# EAGLE design hv4layerSWV2 (EAGLE 6.6.0)
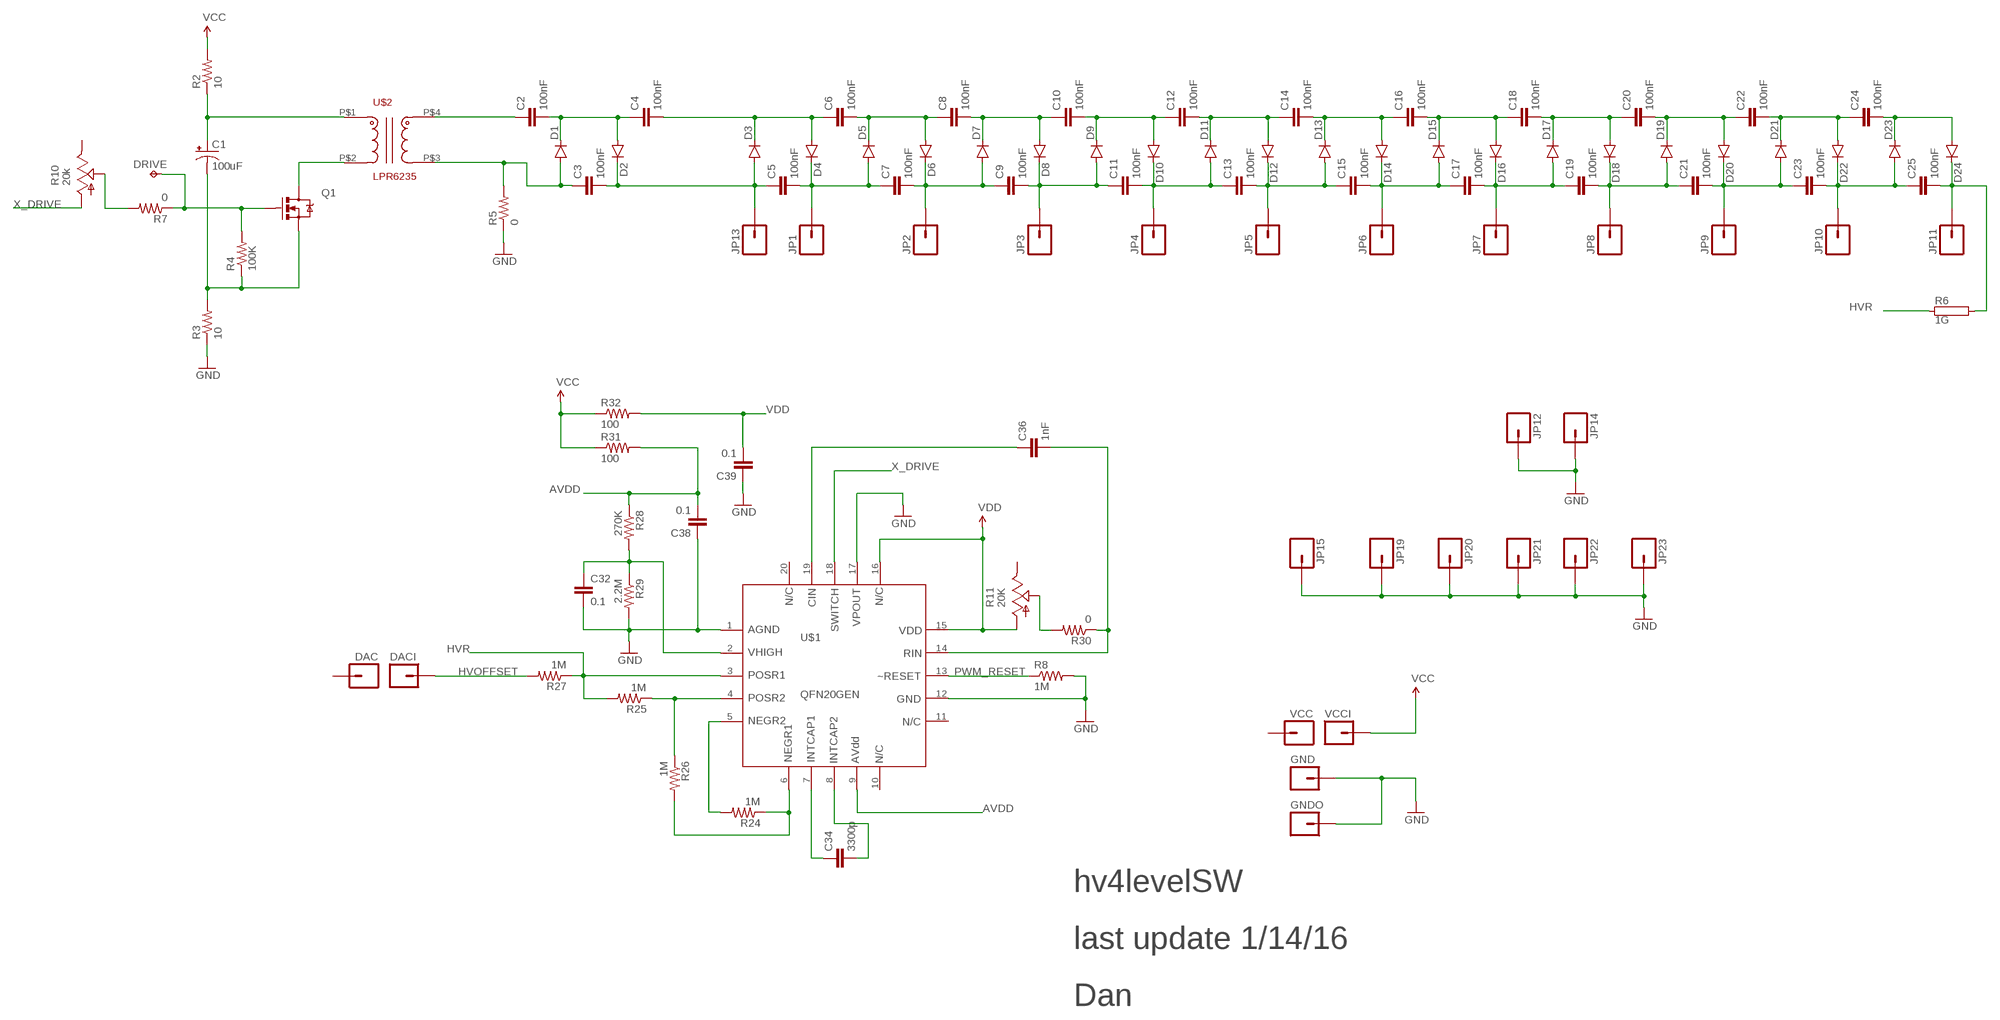
[diagram p0: schematic, sheet 1]

## Parts
C1  100uF  CAP_POL6032  [EIA6032]
C2  100nF  CAP1210  [1210]
C3  100nF  CAP1210  [1210]
C4  100nF  CAP1210  [1210]
C5  100nF  CAP1210  [1210]
C6  100nF  CAP1210  [1210]
C7  100nF  CAP1210  [1210]
C8  100nF  CAP1210  [1210]
C9  100nF  CAP1210  [1210]
C10  100nF  CAP1210  [1210]
C11  100nF  CAP1210  [1210]
C12  100nF  CAP1210  [1210]
C13  100nF  CAP1210  [1210]
C14  100nF  CAP1210  [1210]
C15  100nF  CAP1210  [1210]
C16  100nF  CAP1210  [1210]
C17  100nF  CAP1210  [1210]
C18  100nF  CAP1210  [1210]
C19  100nF  CAP1210  [1210]
C20  100nF  CAP1210  [1210]
C21  100nF  CAP1210  [1210]
C22  100nF  CAP1210  [1210]
C23  100nF  CAP1210  [1210]
C24  100nF  CAP1210  [1210]
C25  100nF  CAP1210  [1210]
C32  0.1  22UF-6.3V-20%(0805)  [0805]
C34  3300p  22UF-6.3V-20%(0805)  [0805]
C36  1nF  22UF-6.3V-20%(0805)  [0805]
C38  0.1  22UF-6.3V-20%(0805)  [0805]
C39  0.1  22UF-6.3V-20%(0805)  [0805]
D1  DIODESOT23  [SOT23-3]
D2  DIODESOT23  [SOT23-3]
D3  DIODESOT23  [SOT23-3]
D4  DIODESOT23  [SOT23-3]
D5  DIODESOT23  [SOT23-3]
D6  DIODESOT23  [SOT23-3]
D7  DIODESOT23  [SOT23-3]
D8  DIODESOT23  [SOT23-3]
D9  DIODESOT23  [SOT23-3]
D10  DIODESOT23  [SOT23-3]
D11  DIODESOT23  [SOT23-3]
D12  DIODESOT23  [SOT23-3]
D13  DIODESOT23  [SOT23-3]
D14  DIODESOT23  [SOT23-3]
D15  DIODESOT23  [SOT23-3]
D16  DIODESOT23  [SOT23-3]
D17  DIODESOT23  [SOT23-3]
D18  DIODESOT23  [SOT23-3]
D19  DIODESOT23  [SOT23-3]
D20  DIODESOT23  [SOT23-3]
D21  DIODESOT23  [SOT23-3]
D22  DIODESOT23  [SOT23-3]
D23  DIODESOT23  [SOT23-3]
D24  DIODESOT23  [SOT23-3]
DAC  M01PTH  [1X01]
DACI  M01PTH  [1X01]
DRIVE  TPTP20R  [TP20R]
GND  M01PTH  [1X01]
GNDO  M01PTH  [1X01]
JP1  M01PTH  [1X01]
JP2  M01PTH  [1X01]
JP3  M01PTH  [1X01]
JP4  M01PTH  [1X01]
JP5  M01PTH  [1X01]
JP6  M01PTH  [1X01]
JP7  M01PTH  [1X01]
JP8  M01PTH  [1X01]
JP9  M01PTH  [1X01]
JP10  M01PTH  [1X01]
JP11  M01PTH  [1X01]
JP12  M01PTH  [1X01]
JP13  M01PTH  [1X01]
JP14  M01PTH  [1X01]
JP15  M01PTH  [1X01]
JP19  M01PTH  [1X01]
JP20  M01PTH  [1X01]
JP21  M01PTH  [1X01]
JP22  M01PTH  [1X01]
JP23  M01PTH  [1X01]
Q1  MOSFET-NCHANNELAO3404A  [SOT23-3]
R2  10  RESISTOR2512  [R2512]
R3  10  RESISTOR2512  [R2512]
R4  100K  RESISTOR0805-RES  [0805]
R5  0  RESISTOR0805-RES  [0805]
R6  1G  RCA4090  [CA4090]
R7  0  RESISTOR0805-RES  [0805]
R8  1M  RESISTOR0805-RES  [0805]
R10  20k  TRIM_US-3223W  [3223W]
R11  20K  TRIM_US-3223W  [3223W]
R24  1M  RESISTOR0805-RES  [0805]
R25  1M  RESISTOR0805-RES  [0805]
R26  1M  RESISTOR0805-RES  [0805]
R27  1M  RESISTOR0805-RES  [0805]
R28  270K  RESISTOR0805-RES  [0805]
R29  2.2M  RESISTOR0805-RES  [0805]
R30  0  RESISTOR0805-RES  [0805]
R31  100  RESISTOR0805-RES  [0805]
R32  100  RESISTOR0805-RES  [0805]
U$1  QFN20GEN  [QFN20]
U$2  LPR6235  [LPR6235]
VCC  M01PTH  [1X01]
VCCI  M01PTH  [1X01]

## Nets
AVDD: C38.2 R28.1 R31.2 U$1.9
GND: C32.2 C38.1 C39.1 GND.1 GNDO.1 JP12.1 JP14.1 JP15.1 JP19.1 JP20.1 JP21.1 JP22.1 JP23.1 R3.1 R5.1 R8.2 R29.2 U$1.1 U$1.12 U$1.17
HVOFFSET: DACI.1 R27.2
HVR: R6.1 R25.2 R27.1 U$1.3
N$1: C2.1 U$2.P$4
N$2: C1.P$2(-) Q1.2(S) R3.2 R4.1
N$3: C3.1 D1.1(A) R5.2 U$2.P$3
N$4: DRIVE.TP Q1.1(G) R4.2 R7.1
N$5: C2.2 C4.1 D1.3(C) D2.1(A)
N$6: R24.1 R26.2 U$1.6
N$7: Q1.3(D) U$2.P$2
N$8: R11.2(S) R30.2
N$9: C3.2 C5.1 D2.3(C) D3.1(A) JP13.1
N$10: C4.2 C6.1 D3.3(C) D4.1(A)
N$11: C5.2 C7.1 D4.3(C) D5.1(A) JP1.1
N$12: C6.2 C8.1 D5.3(C) D6.1(A)
N$13: C7.2 C9.1 D6.3(C) D7.1(A) JP2.1
N$14: C23.2 C25.1 D22.3(C) D23.1(A) JP10.1
N$15: R24.2 U$1.5
N$18: C8.2 C10.1 D7.3(C) D8.1(A)
N$20: C9.2 C11.1 D8.3(C) D9.1(A) JP3.1
N$21: C1.P$1(+) R2.1 U$2.P$1
N$22: C10.2 C12.1 D9.3(C) D10.1(A)
N$23: C11.2 C13.1 D10.3(C) D11.1(A) JP4.1
N$24: C12.2 C14.1 D11.3(C) D12.1(A)
N$25: C14.2 C16.1 D13.3(C) D14.1(A)
N$26: C13.2 C15.1 D12.3(C) D13.1(A) JP5.1
N$27: C15.2 C17.1 D14.3(C) D15.1(A) JP6.1
N$28: C17.2 C19.1 D16.3(C) D17.1(A) JP7.1
N$29: C19.2 C21.1 D18.3(C) D19.1(A) JP8.1
N$30: C16.2 C18.1 D15.3(C) D16.1(A)
N$31: C18.2 C20.1 D17.3(C) D18.1(A)
N$32: C20.2 C22.1 D19.3(C) D20.1(A)
N$33: C21.2 C23.1 D20.3(C) D21.1(A) JP9.1
N$34: C22.2 C24.1 D21.3(C) D22.1(A)
N$35: C24.2 D23.3(C) D24.1(A)
N$36: C25.2 D24.3(C) JP11.1 R6.2
N$37: R7.2 R10.2(S)
N$43: C34.1 U$1.7
N$49: R25.1 R26.1 U$1.4
N$61: C34.2 U$1.8
N$63: C32.1 R28.2 R29.1 U$1.2
N$64: C36.2 R30.1 U$1.14
N$65: C36.1 U$1.19
PWM_RESET: R8.1 U$1.13
VCC: R2.2 R31.1 R32.1 VCCI.1
VDD: C39.2 R11.1(A) R32.2 U$1.15 U$1.16
X_DRIVE: R10.1(A) U$1.18
Unconnected: DAC.1 R10.3(E) R11.3(E) U$1.10 U$1.11 U$1.20 VCC.1

## Notes on the sheet
- hv4levelSW
- last update 1/14/16
- Dan

## Library data of the parts
C1 = SparkFun-Capacitors:CAP_POL: Capacitor Polarized These are standard SMD and PTH capacitors. Normally 10uF, 47uF, and 100uF in electrolytic and tantalum varieties. Always verify the external diameter of the through hole cap, it varies with capacity, voltage, and manufacturer. The EIA devices should be standard.
C2-C25 = SparkFun-Capacitors:CAP: Capacitor Standard 0603 ceramic capacitor, and 0.1" leaded capacitor.
C32 C34 C36 C38 C39 = SparkFun-Capacitors:22UF-6.3V-20%(0805): CAP-08402 Ceramic; PROD_ID: CAP-08402; VALUE: 22uF
D1-D24 = SparkFun-DiscreteSemi:DIODE: Diode These are standard reverse protection diodes and small signal diodes. SMA package can handle up to about 1A. SOD-323 can handle about 200mA. What the SOD-323 package when ordering, there are some mfgs out there that are 5-pin packages.
DAC DACI GND GNDO JP1-JP15 JP19-JP23 VCC VCCI = SparkFun-Connectors:M01: Header 1 Standard 1-pin 0.1" header. Use with straight break away headers (SKU : PRT-00116), right angle break away headers (PRT-00553), swiss pins (PRT-00743), machine pins (PRT-00117), and female headers (PRT-00115).
DRIVE = testpad:TP: Test pad
Q1 = SparkFun-DiscreteSemi:MOSFET-NCHANNEL: Common NMOSFET Parts MFG P/N Store ID Prod ID FDD8780 TRANS-09984 SI7820DN TRANS-11055 FDS6630A IC-08089 2N7002PW TRANS-11151 FQP30N06L COM-10213 TRANS-10060 BSS123LT1G TRANS-08345 BSS138 TRANS-00830 BS170 2N7000; PROD_ID: TRAN-12988
R2 R3 = SparkFun-Resistors:RESISTOR: Resistor Basic schematic elements and footprints for 0603, 1206, and PTH resistors.
R4 R5 R7 R8 R24-R32 = SparkFun-Passives:RESISTOR: Resistor Basic schematic elements and footprints for 0603, 1206, and PTH resistors.
R6 = resistor-power:R: Power Resitor; OC_FARNELL: unknown; OC_NEWARK: unknown
R10 R11 = pot:TRIM_US-: POTENTIOMETER
U$1 = specials:QFN20GEN
U$2 = inductor-coilcraft-2:LPR6235

## Board
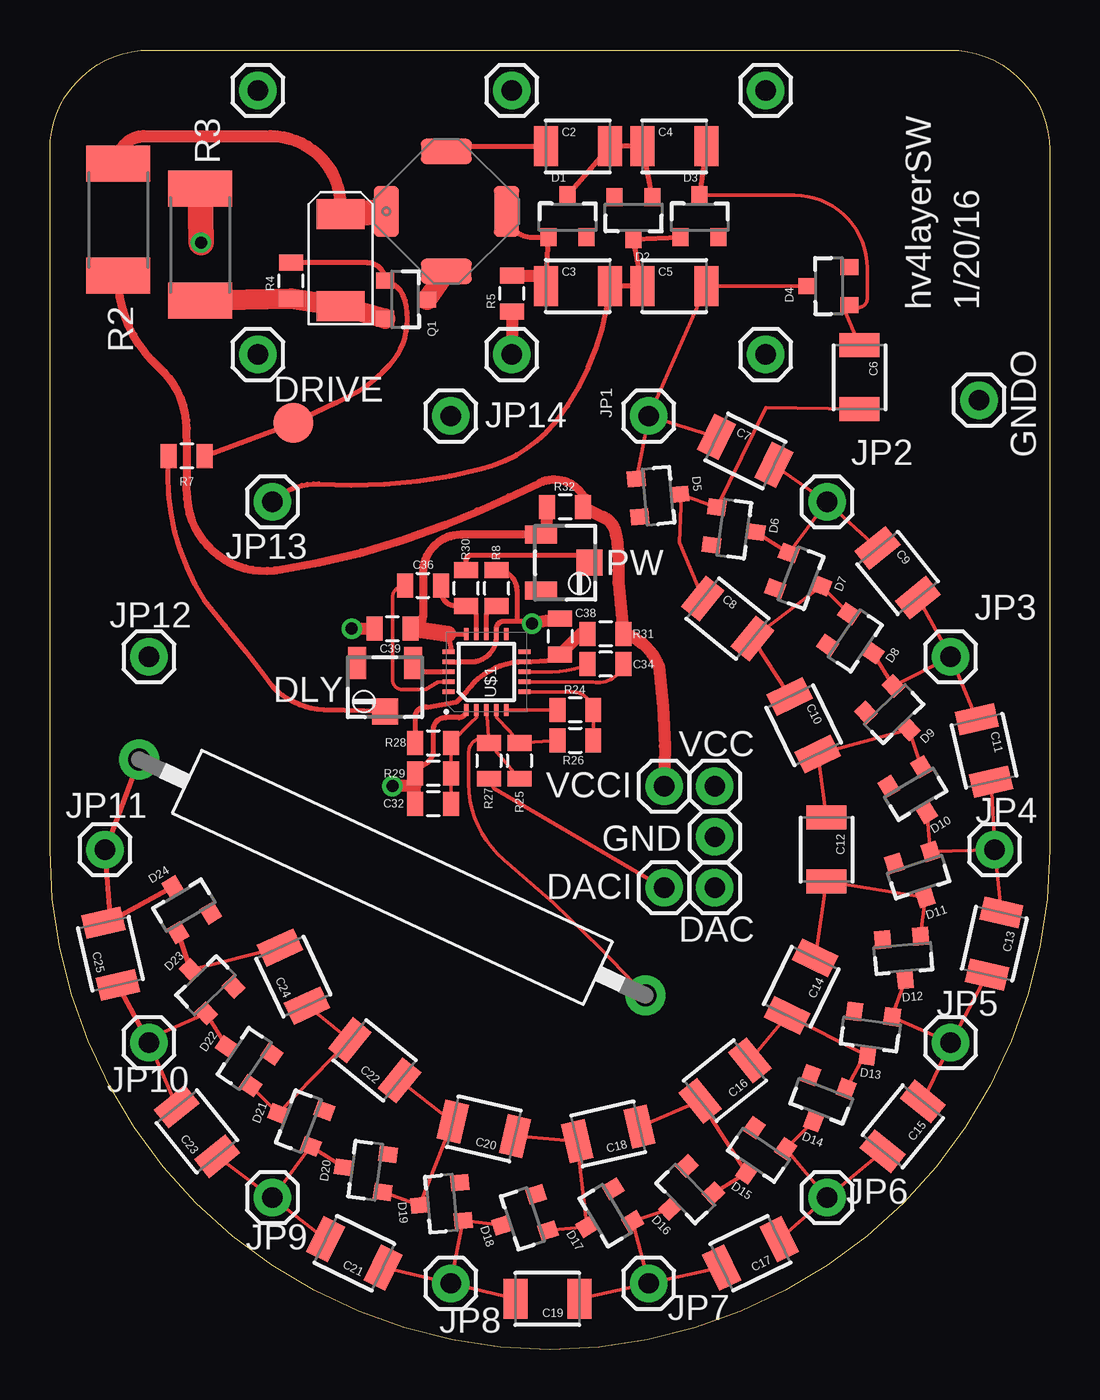
[diagram p1: board, top side]
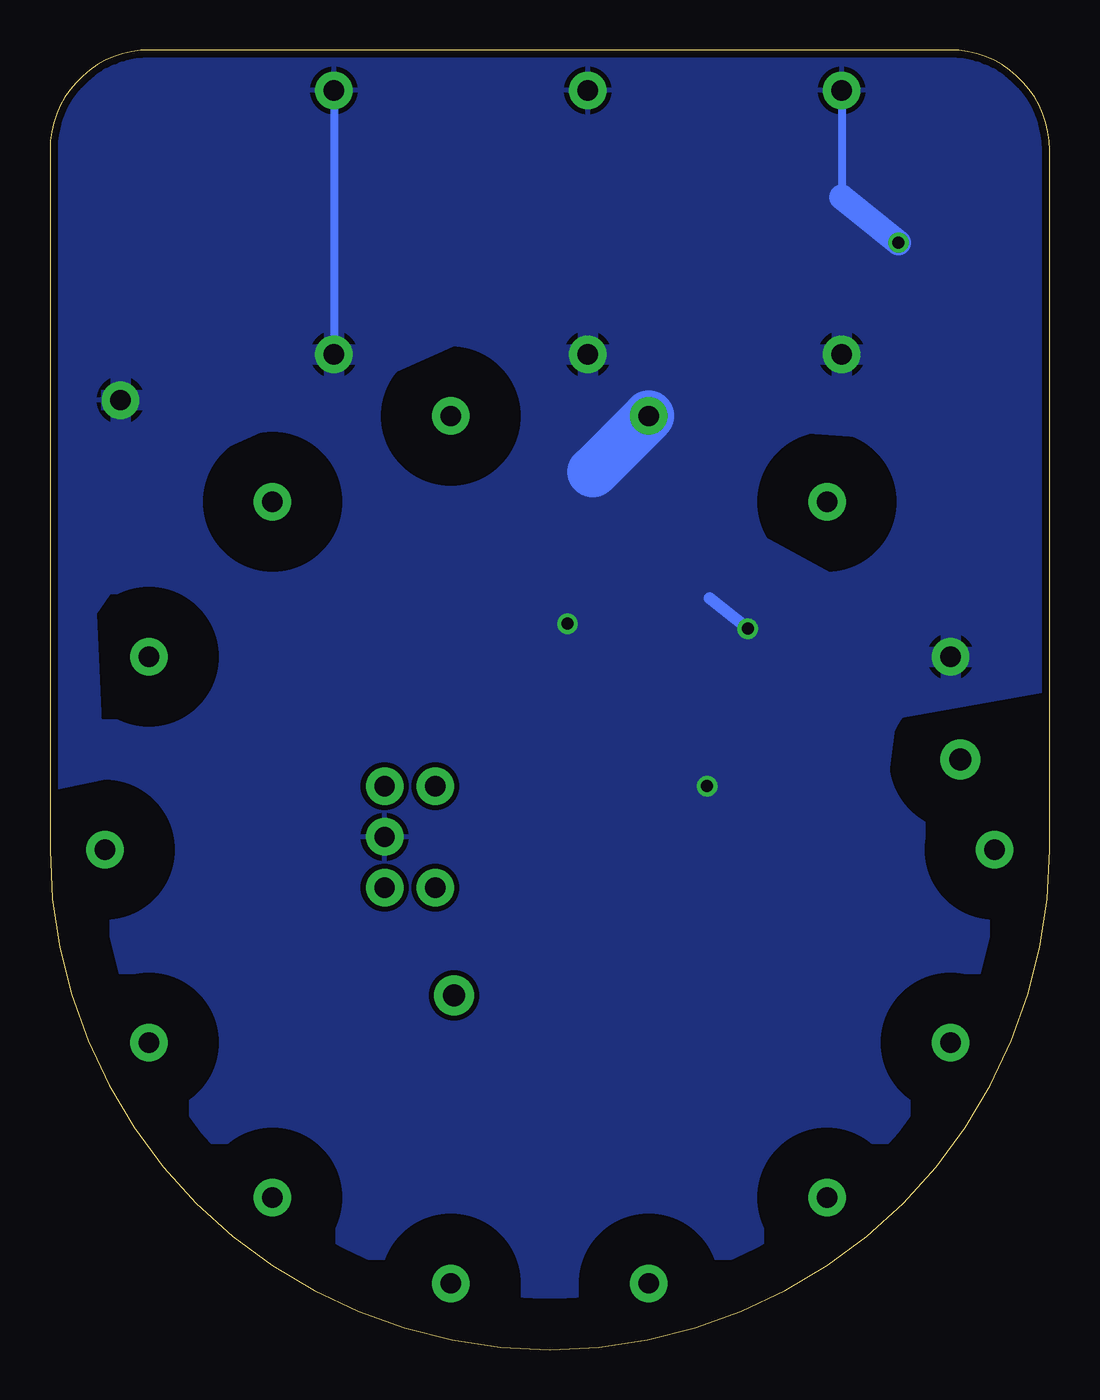
[diagram p2: board, bottom side, seen from below]

Size 50 x 65 mm. Coordinates in mm from the lower left corner, seen from the top.
Outline: 0,25 0,60 arc-90 5,65 45,65 arc-90 50,60 50,25 arc-180 0,25
Copper layers (1*16): Top 0.0356mm / dielectric 1.5011mm / Bottom 0.0356mm
Design rules "oshpark": minimum track width 6mil, minimum drill 13mil, track to track 6mil, track to pad 6mil, pad to pad 6mil, via to via 6mil, smd to smd 6mil, copper to edge 15mil, drill to drill 6mil, minimum pad ring 7mil, minimum via ring 7mil, stop-mask expansion 3mil, vias tented up to drill 0mil, thermal gap 10mil

### Footprints (pad centres in the part's own frame; a part is rotated, then mirrored left to right if it is on the bottom)
EIA6032 = smd 1.5 x 2.4: P$1 -2.3,0; P$2 2.3,0
1210 = smd 1.2 x 2: 1 -1.6,0; 2 1.6,0
0805 = smd 0.8 x 1.2: 1 -0.9,0; 2 0.9,0
SOT23-3 = smd 0.8 x 0.9: 1 -0.95,-1; 2 0.95,-1; 3 0,1.1
1X01 = drill 1.016 pad 1.88: 1 0,0
TP20R = smd 2 x 2: TP 0,0
R2512 = smd 1.8 x 3.2: 1 -2.8,0; 2 2.8,0
CA4090 = drill 1.1 pad 2: 1 -13.97,0; 2 13.97,0
3223W = smd 0.9 x 1.6: 1 -1.4,-1.215; 3 1.4,-1.215 | smd 1.3 x 1.3: 2 0,1.215
QFN20 = smd 0.6 x 0.23: 1 -1.9,1; 2 -1.9,0.5; 3 -1.9,0; 4 -1.9,-0.5; 5 -1.9,-1; 11 1.9,-1; 12 1.9,-0.5; 13 1.9,0; 14 1.9,0.5; 15 1.9,1 | smd 0.23 x 0.6: 6 -1,-1.9; 7 -0.5,-1.9; 8 0,-1.9; 9 0.5,-1.9; 10 1,-1.9; 16 1,1.9; 17 0.5,1.9; 18 0,1.9; 19 -0.5,1.9; 20 -1,1.9
LPR6235 = smd 2.54 x 1.27 rotated 45: P$1 -2.125,2.125; P$3 2.125,-2.125 | smd 2.54 x 1.27 rotated 135: P$2 -2.125,-2.125; P$4 2.125,2.125

### Placement (x,y rotation side)
C1  14.53,54.5 270 top
C2  26.4,60.18 0 top
C3  26.4,53.2 0 top
C4  31.23,60.18 0 top
C5  31.23,53.2 0 top
C6  40.5,48.63 270 top
C7  34.78,44.94 334 top
C8  33.9,36.56 321 top
C9  42.4,38.85 309 top
C10  37.7,31.23 296 top
C11  46.72,29.96 283 top
C12  38.85,25.01 270 top
C13  47.23,20.31 257 top
C14  37.58,18.15 244 top
C15  42.66,11.16 231 top
C16  33.77,13.45 219 top
C17  35.04,4.81 206 top
C18  27.93,10.78 193 top
C19  24.88,2.53 180 top
C20  21.7,11.04 167 top
C21  15.23,4.81 154 top
C22  16.24,14.46 141 top
C23  7.35,10.91 129 top
C24  12.18,18.66 115 top
C25  3.03,19.8 103 top
C32  19.16,27.29 180 top
C34  27.8,34.28 180 top
C36  18.66,38.21 0 top
C38  25.51,35.67 270 top
C39  17.13,36.05 0 top
D1  25.89,56.63 0 top
D2  29.2,56.63 180 top
D3  32.5,56.63 0 top
D4  38.98,53.2 90 top
D5  30.41,42.69 275 top
D6  34.21,41.04 262 top
D7  37.55,38.59 249 top
D8  40.26,35.46 236 top
D9  42.2,31.8 224 top
D10  43.29,27.8 211 top
D11  43.45,23.66 198 top
D12  42.69,19.59 185 top
D13  41.04,15.79 172 top
D14  38.59,12.45 159 top
D15  35.46,9.74 146 top
D16  31.8,7.8 134 top
D17  27.8,6.71 121 top
D18  23.66,6.55 108 top
D19  19.59,7.31 95 top
D20  15.79,8.96 82 top
D21  12.45,11.41 69 top
D22  9.74,14.54 56 top
D23  7.8,18.2 44 top
D24  6.71,22.2 31 top
DAC  33.26,23.1 0 top
DACI  30.72,23.1 0 top
DRIVE  12.18,46.34 0 top
GND  33.26,25.64 0 top
GNDO  46.47,47.48 0 top
JP1  29.95,46.69 0 top
JP2  38.87,42.4 0 top
JP3  45.05,34.65 0 top
JP4  47.25,25 0 top
JP5  45.05,15.35 0 top
JP6  38.87,7.6 0 top
JP7  29.95,3.31 0 top
JP8  20.05,3.31 0 top
JP9  11.13,7.6 0 top
JP10  4.95,15.35 0 top
JP11  2.75,25 0 top
JP12  4.95,34.65 0 top
JP13  11.13,42.4 0 top
JP14  20.05,46.69 0 top
JP15  10.4,62.98 0 top
JP19  23.1,62.98 0 top
JP20  35.8,49.77 0 top
JP21  23.1,49.77 0 top
JP22  10.4,49.77 0 top
JP23  35.8,62.98 0 top
Q1  17.76,52.52 270 top
R2  3.41,56.5 270 top
R3  7.5,55.26 270 top
R4  12.05,53.45 90 top
R5  23.1,52.82 90 top
R6  17.13,23.61 155 top
R7  6.84,44.69 180 top
R8  22.34,38.09 90 top
R10  16.75,33.13 180 top
R11  25.77,39.36 270 top
R24  26.27,31.99 180 top
R25  23.48,29.45 270 top
R26  26.27,30.47 0 top
R27  21.96,29.45 270 top
R28  19.16,30.34 0 top
R29  19.16,28.81 180 top
R30  20.81,38.09 90 top
R31  27.8,35.8 180 top
R32  25.77,42.15 180 top
U$1  21.83,33.9 90 top
U$2  19.83,56.92 45 top
VCC  33.26,28.18 0 top
VCCI  30.72,28.18 0 top

### Tracks (layer width: path | path; a pad name or v marks a point on that pad's centre or on a via)
AVDD
  Top 0.254: C38.2 arc-90 25.24,34.5 U$1.9 arc55 20.81,32.88 20.31,32.37 18.91,32.12 arc90 18.26,31.73 R28.1
  Top 0.61: C38.2 26.54,35.8 R31.2
GND  (via drill 0.6 pad 1.02)
  Top 0.178: U$1.17 | U$1.12 22.33,36.05 | 20.56,34.4
  Top 0.254: U$1.17 20.56,34.4 | 20.56,34.4 21.19,34.4 arc90 U$1.12 | 22.33,36.05 arc-90 22.72,36.44 23.35,36.44 | R8.2 arc-90 23.35,37.97 23.35,36.44 | U$1.1 arc-90 20.44,31.61 19.8,31.61 arc90 19.16,30.97 19.16,30.09 arc-90 18.53,29.2 R29.2 | 23.35,36.44 24.12,36.44 v24.12,36.31
  Top 0.61: R5.1 JP21.1 | C38.1 v24.12,36.31 | C32.2 R29.2 arc-90 18.27,28.93 18.27,28.18 v17.13,28.18 | v15.1,36.05 C39.1
  Top 1.27: R3.1 v7.55,55.36
  Bottom 0.406: JP15.1 10.4,57.64 | JP23.1 JP20.1
  Bottom 0.61: v15.1,36.05 17,37.58
  Bottom 1.27: v7.55,55.36 10.4,57.64
  Bottom 2.54: 22.85,43.89 JP14.1
  pour Bottom (isolate 0.254): -0.14,33.01 7.73,31.61 9.13,20.81 12.43,11.67 20.94,8.62 29.45,6.84 38.09,14.59 41.64,19.8 41.9,27.04 40.12,35.8 35.67,39.99 30.59,41.01 20.43,43.93 10.4,38.47 3.29,42.15 7.86,45.58 23.73,46.72 27.8,51.17 42.28,44.69 47.74,36.82 47.36,28.56 49.77,28.05 50.41,29.58 50.79,65.52 -0.01,65.26
  pour Bottom (isolate 2.54): -0.14,52.56 50.41,52.31 50.41,0.11 0.37,0.11
HVOFFSET
  Top 0.178: R27.2 22.21,28.05 DACI.1
HVR
  Top 0.178: 21.83,31.86 U$1.3 R27.1 | R27.1 21.71,30.6 arc90 20.94,29.83 20.94,28.31 arc50 22.72,24.5 arc-8 R6.1 | R27.1 R25.2
N$1
  Top 0.254: U$2.P$4 arc-90 20.08,60.18 C2.1
N$2
  Top 1.016: Q1.2 C1.P$2 R4.1 R3.2
N$3
  Top 0.178: 24.28,53.72 arc-90 C3.1
  Top 0.254: C3.1 D1.1 24.13,55.63 arc-90 U$2.P$3
  Top 0.61: R5.2 24.28,53.72
N$4
  Top 0.254: R4.2 15.88,54.35 arc-90 Q1.1 arc-60 17.77,52.47 arc-57 17,49.26 arc-22 14.84,47.61 14.34,47.36 DRIVE.TP R7.1
N$5
  Top 0.254: D1.3 C2.2 C4.1 D2.1
N$6
  Top 0.178: U$1.6 23.73,32.88 25.91,32.88 arc-90 R24.1 R26.2
N$7
  Top 1.016: Q1.3 U$2.P$2
N$8
  Top 0.254: R30.2 20.81,39.48 arc-90 21.07,39.74 26.6,39.74 arc-90 R11.2
N$9
  Top 0.178: JP13.1
  Top 0.254: D3.1 D2.3 C5.1 C3.2 arc-33 25.26,46.34 arc-36 21.58,44.05 arc-19 13.45,43.29 arc48 JP13.1
N$10
  Top 0.178: 40.37,52.06 39.74,52.01 | 39.74,52.01 D4.1 40.44,52.12 arc90 40.88,52.56 40.88,54.09 arc90 37.24,57.73 D3.3 | C6.1 39.74,52.01
  Top 0.254: C4.2 D3.3
N$11
  Top 0.178: D4.3 C5.2 JP1.1 | C7.1 JP1.1 | D5.1 JP1.1
N$12
  Top 0.178: D5.3 31.6,42.75 | 31.6,42.75 D6.1 35.8,47.1 C6.2 | C8.1 31.48,40.37 31.6,42.75
N$13
  Top 0.178: C9.1 JP2.1 | JP2.1 D7.1 D6.3 | C7.2 JP2.1
N$14
  Top 0.178: 4.86,15.51 D23.1 D22.3 | C23.2 JP10.1
  Top 0.254: JP10.1 4.86,15.51 C25.1
N$15
  Top 0.178: U$1.5 R24.2
N$18
  Top 0.178: C10.1 C8.2 D7.3 D8.1
N$20
  Top 0.178: C11.1 JP3.1 | JP3.1 D9.1 D8.3 | C9.2 JP3.1
N$21
  Top 0.254: R2.1 3.42,59.43
  Top 0.61: 3.42,59.43 arc-90 4.68,60.69 11.04,60.69 arc-90 14.53,57.2 C1.P$1
  Top 1.27: C1.P$1 U$2.P$1
N$22
  Top 0.178: C12.1 C10.2 D9.3 D10.1
N$23
  Top 0.178: C13.1 JP4.1 | JP4.1 D11.1 D10.3 | C11.2 JP4.1
N$24
  Top 0.178: D12.1 D11.3 C12.2 C14.1
N$25
  Top 0.178: C16.1 C14.2 40.77,14.76 | D13.3 40.77,14.76 | D14.1 40.77,14.76
N$26
  Top 0.178: JP5.1 C15.1 | JP5.1 D13.1 D12.3 | C13.2 JP5.1
N$27
  Top 0.178: D14.3 D15.1 JP6.1 | C17.1 JP6.1 | JP6.1 C15.2
N$28
  Top 0.178: C19.1 JP7.1 | JP7.1 D17.1 D16.3 | C17.2 JP7.1
N$29
  Top 0.178: C21.1 JP8.1 | JP8.1 D19.1 D18.3 | C19.2 JP8.1
N$30
  Top 0.178: C18.1 C16.2 D15.3 D16.1
N$31
  Top 0.178: C20.1 C18.2 D17.3 D18.1
N$32
  Top 0.178: C22.1 C20.2 D19.3 D20.1
N$33
  Top 0.178: 11.07,7.65 JP9.1 D21.1 D20.3 | 11.07,7.65 C23.1 | C21.2 11.07,7.65
N$34
  Top 0.178: C22.2 14.98,15.49 | 14.98,15.49 C24.1 | 14.98,15.49 D21.3 D22.1
N$35
  Top 0.178: C24.2 D23.3
  Top 0.254: D23.3 D24.1
N$36
  Top 0.254: R6.2 JP11.1 3.03,21.45 | C25.2 3.03,21.45 | D24.3 3.03,21.45
N$37
  Top 0.254: R10.2 13.7,31.99 arc-54 10.78,33.64 arc2 7.73,37.45 arc-37 R7.2
N$43
  Top 0.178: U$1.7 27.16,33.39 arc82 C34.1
N$49
  Top 0.178: R26.1 R25.1 22.97,30.97 22.33,31.62 U$1.4
N$61
  Top 0.178: U$1.8 24.75,33.9 arc26 C34.2
N$63
  Top 0.178: 21.32,31.99 U$1.2 21.33,31.62 21.07,31.35 R28.2 R29.1 C32.1
N$64
  Top 0.254: U$1.14 21.33,36.67 arc90 R30.1 | 20.81,37.45 R30.1 | R30.1 arc-90 R30.1 | C36.2 19.55,37.95 arc90 20.31,37.2 R30.1 | R30.1 arc-90 R30.1
N$65
  Top 0.178: C36.1 arc90 17.13,37.59 17.13,33.51 arc90 17.64,33.01 18.78,33.01 19.42,33.4 U$1.19
PWM_RESET
  Top 0.254: U$1.13 21.83,36.68 arc-90 R8.1
VCC
  Top 0.406: 26.78,42.53 arc90 24.5,43.34 arc-4 19.8,41.26 arc-13 11.24,38.98 arc-98 6.84,42.91 arc2 6.84,46.09 arc47 5.45,49.14 arc-49 R2.2
  Top 0.61: VCCI.1 arc10 30.47,34.15 arc48 28.81,35.8 R31.1 28.43,38.35 28.43,38.98 arc14 28.31,40.75 arc61 27.67,41.64 R32.1 arc-90 26.78,42.03 | 26.78,42.03 26.78,41.9 | 26.78,42.03 26.78,42.53
VDD
  Top 0.254: U$1.15 19.92,35.8 20.05,35.02 U$1.16
  Top 0.406: R11.1 20.56,40.76 arc90 18.66,38.85 18.66,36.68 arc-90 C39.2
  Top 0.61: R11.1 arc90 24.87,41.07 R32.2
  Top 0.813: C39.2 19.92,35.8
X_DRIVE
  Top 0.254: U$1.18 18.15,33.9 R10.1

### Text on the board
tPlace: hv4layerSW | 1/20/16
tNames: PW | DLY